# EAGLE design SD (EAGLE 7.2.0)
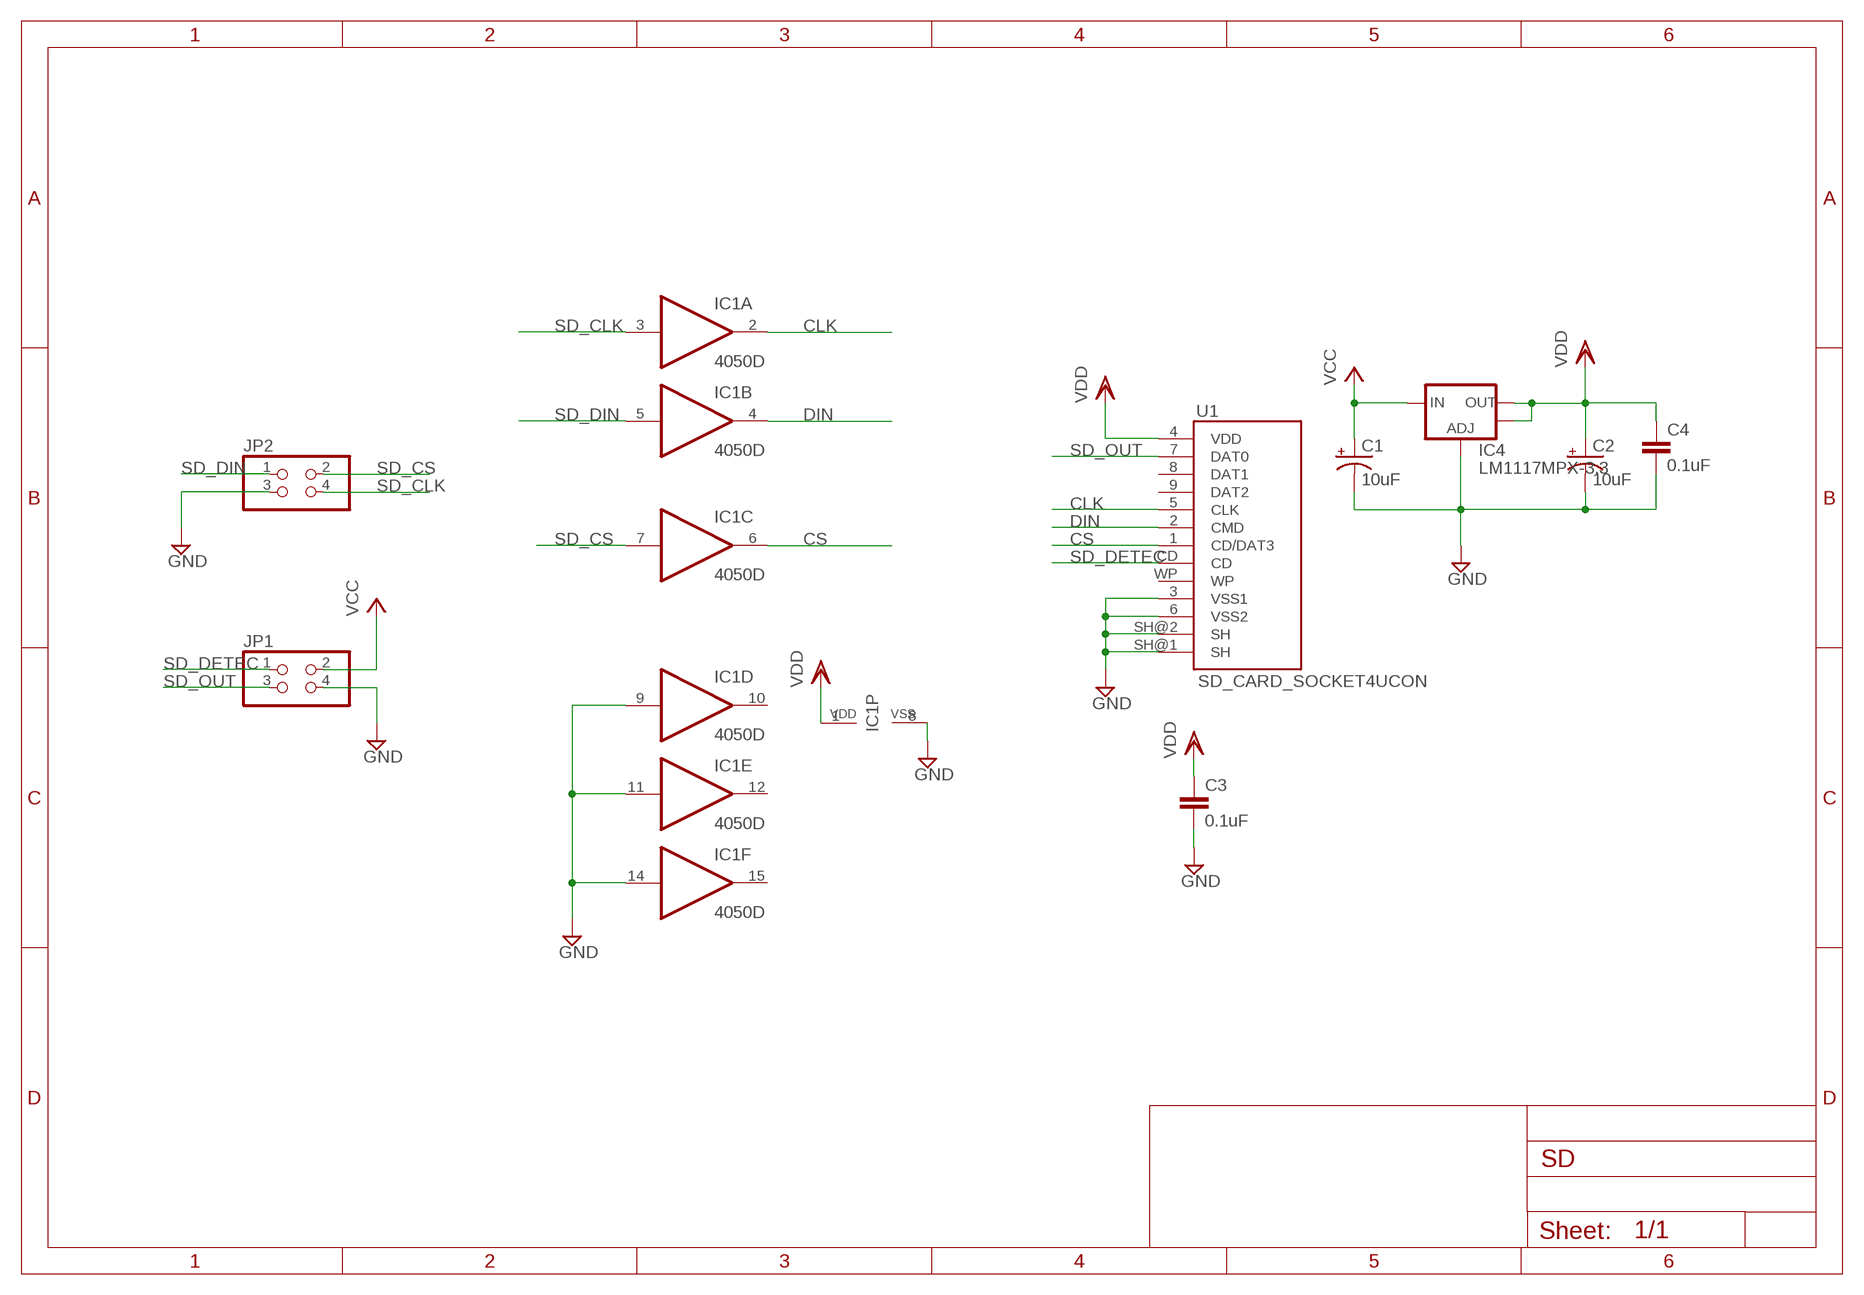
[diagram p0: schematic, sheet 1]

## Parts
C1  10uF  CPOL-USCT3216  [CT3216]
C2  10uF  CPOL-USCT3216  [CT3216]
C3  0.1uF  C-EUC0805  [C0805]
C4  0.1uF  C-EUC0805  [C0805]
IC1  4050D  [SO16]
IC4  LM1117MPX-3.3  V_REG_LM1117SOT223  [SOT223]
JP1  PINHD-2X2  [2X02]
JP2  PINHD-2X2  [2X02]
U1  SD_CARD_SOCKET4UCON  [SDCARD_4UCONN]

## Nets
CLK: IC1.2(A:O) U1.5(CLK)
CS: IC1.6(C:O) U1.1(CD/DAT3)
DIN: IC1.4(B:O) U1.2(CMD)
GND: C1.- C2.- C3.2 C4.2 IC1.8(P:VSS) IC1.9(D:I) IC1.11(E:I) IC1.14(F:I) IC4.1(ADJ) JP1.4 JP2.3 U1.3(VSS1) U1.6(VSS2) U1.SH@1(SH) U1.SH@2(SH)
SD_CLK: IC1.3(A:I) JP2.4
SD_CS: IC1.7(C:I) JP2.2
SD_DETEC: JP1.1 U1.CD
SD_DIN: IC1.5(B:I) JP2.1
SD_OUT: JP1.3 U1.7(DAT0)
VCC: C1.+ IC4.3(IN) JP1.2
VDD: C2.+ C3.1 C4.1 IC1.1(P:VDD) IC4.2(OUT) IC4.4(OUT) U1.4(VDD)
Unconnected: IC1.10(D:O) IC1.12(E:O) IC1.15(F:O) U1.8(DAT1) U1.9(DAT2) U1.WP

## Library data of the parts
C1 C2 = resistor:CPOL-US: POLARIZED CAPACITOR, American symbol
C3 C4 = resistor:C-EU: CAPACITOR, European symbol
IC1 = 40xx:4050: Hex non-inverting BUFFER
IC4 = SparkFun:V_REG_LM1117: Voltage Regulator LM1117 Standard adjustable voltage regulator but in SMD form. Spark Fun Electronics SKU : COM-00595
JP1 JP2 = pinhead:PINHD-2X2: PIN HEADER
U1 = SparkFun-Connectors:SD_CARD_SOCKET: SD Memory Card Connector, push-push normal type, CD enable, WP enable

## Board
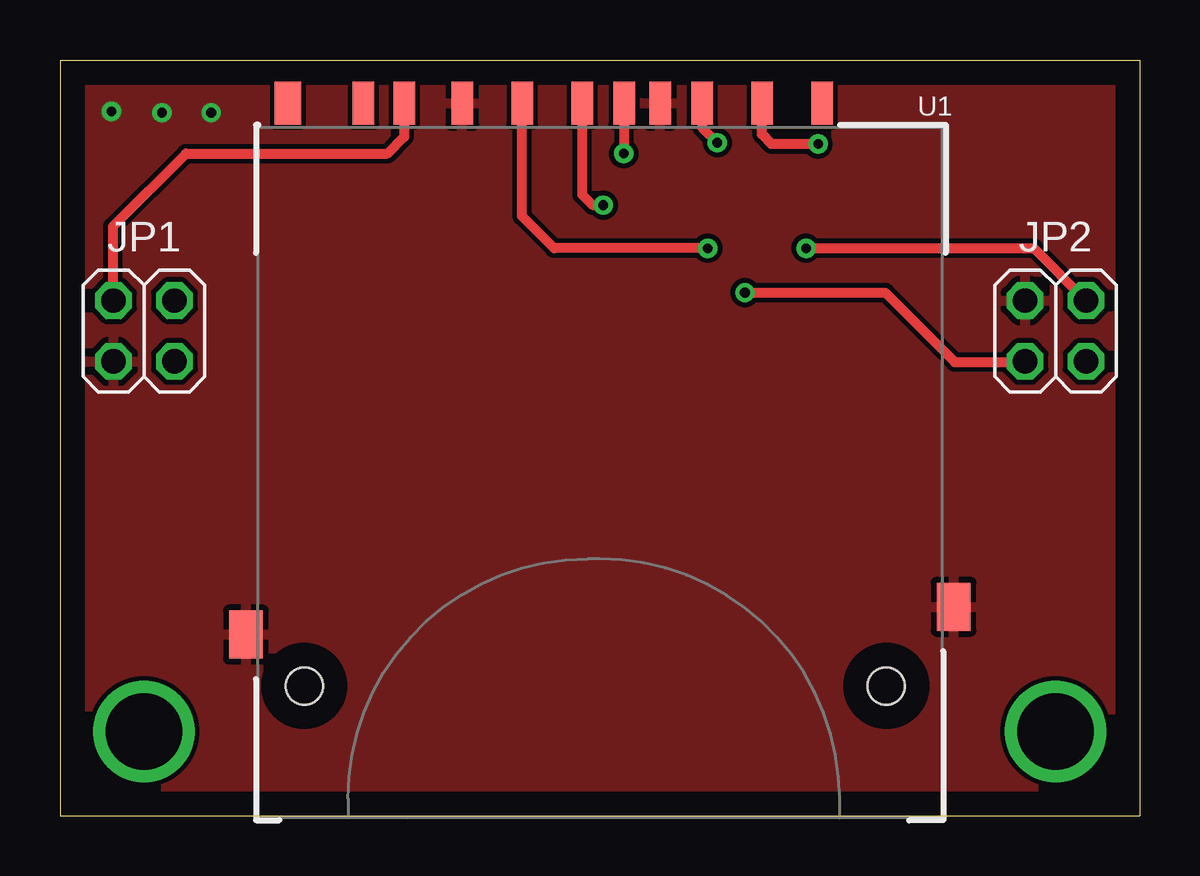
[diagram p1: board, top side]
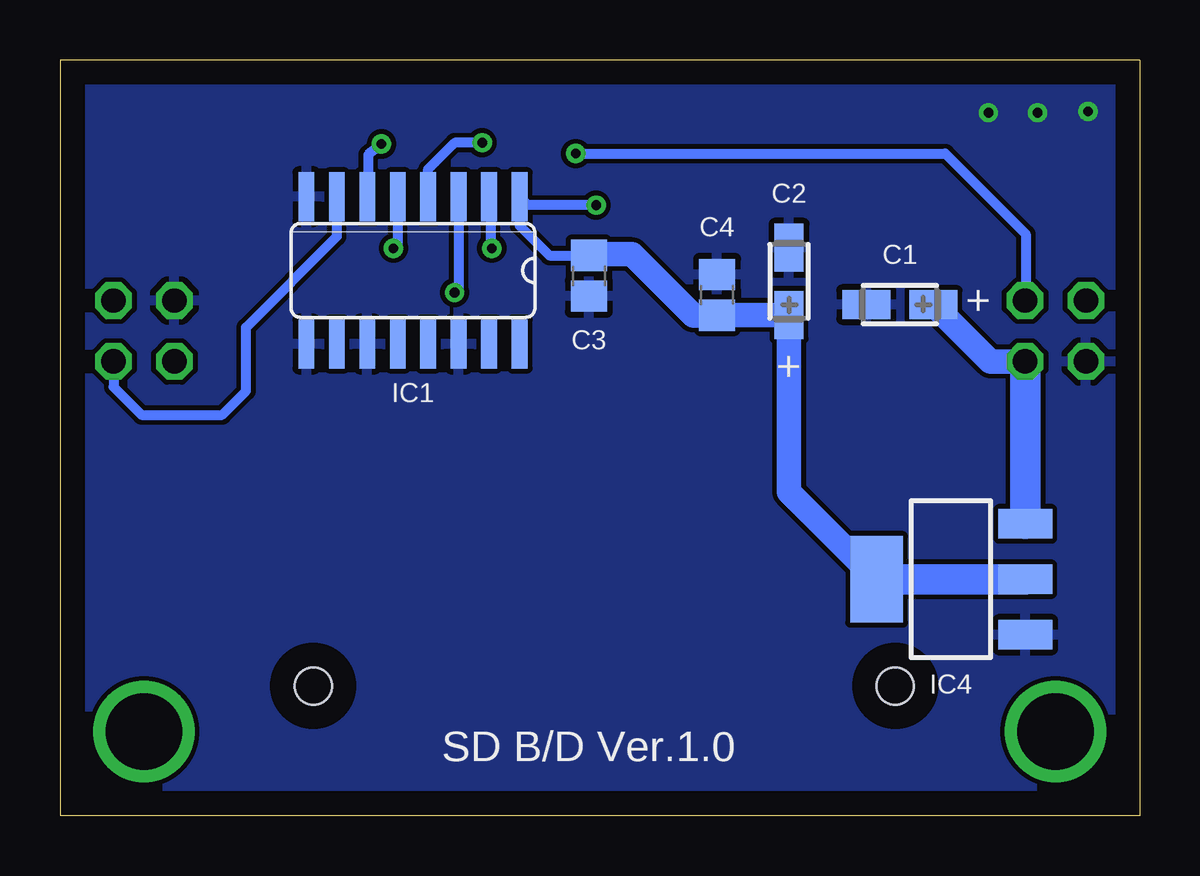
[diagram p2: board, bottom side, seen from below]

Size 45 x 31.5 mm. Coordinates in mm from the lower left corner, seen from the top.
Outline: 45,31.5 45,0 0,0 0,31.5 45,31.5
Copper layers (1*16): Top 0.035mm / dielectric 1.5mm / Bottom 0.035mm
Design rules "default": minimum track width 10mil, minimum drill 24mil, track to track 8mil, track to pad 8mil, pad to pad 8mil, via to via 8mil, smd to smd 8mil, copper to edge 40mil, drill to drill 8mil, minimum pad ring 10mil, minimum via ring 8mil, stop-mask expansion 4mil, vias tented up to drill 0mil, thermal gap 10mil

### Footprints (pad centres in the part's own frame; a part is rotated, then mirrored left to right if it is on the bottom)
CT3216 = smd 2 x 1.2: + 1.4,0; - -1.4,0
C0805 = smd 1.3 x 1.5: 1 -0.85,0; 2 0.85,0
SO16 = smd 0.66 x 2.032: 1 -4.445,-3.073; 2 -3.175,-3.073; 3 -1.905,-3.073; 4 -0.635,-3.073; 5 0.635,-3.073; 6 1.905,-3.073; 7 3.175,-3.073; 8 4.445,-3.073; 9 4.445,3.073; 10 3.175,3.073; 11 1.905,3.073; 12 0.635,3.073; 13 -0.635,3.073; 14 -1.905,3.073; 15 -3.175,3.073; 16 -4.445,3.073
SOT223 = smd 1.219 x 2.235: 1 -2.311,-3.099; 2 0,-3.099; 3 2.311,-3.099 | smd 3.6 x 2.2: 4 0,3.099
2X02 = drill 1.016 octagon: 1 -1.27,-1.27; 2 -1.27,1.27; 3 1.27,-1.27; 4 1.27,1.27
SDCARD_4UCONN = smd 1.8 x 0.9: 1 -1,6.77; 2 -1,4.27; 3 -1,2.52; 4 -1,-0.73; 5 -1,-3.23; 6 -1,-5.73; 7 -1,-8.15; 8 -1,-9.85; 9 -1,9.27; CD -1,1.02 | smd 2 x 1.4: SH@1 20,14.75; SH@2 21.15,-14.75 | smd 1.8 x 1.1: WP -1,-13 | hole 1.55: 23.3,11.94; 23.3,-12.32

### Placement (x,y rotation side)
C1  9.99,21.3 0 bottom
C2  14.61,22.27 270 bottom
C3  22.95,22.5 270 bottom
C4  17.61,21.7 90 bottom
IC1  30.28,22.73 180 bottom
IC4  7.86,9.85 90 bottom
JP1  3.5,20.2 180 top
JP2  41.5,20.2 180 top
U1  22.5,28.7 270 top

### Tracks (layer width: path | path; a pad name or v marks a point on that pad's centre or on a via)
CLK  (via drill 0.4)
  Top 0.406: v27,23.65 20.6,23.65 19.25,25 19.25,29.68 U1.5
  Bottom 0.406: IC1.2 27.05,25.8 | 27.05,25.8 | 27.05,25.8 27.05,23.7 v27,23.65
CS  (via drill 0.4)
  Top 0.406: v31.6,28 29.65,28 29.25,28.4 29.25,29.68 U1.1
  Bottom 0.406: v31.6,28 32.15,27.55 32.15,25.84 IC1.6
DIN  (via drill 0.4)
  Top 0.406: U1.2 26.77,28.68 v27.4,28.05
  Bottom 0.406: v27.4,28.05 28.55,28.05 29.65,26.95 IC1.4
GND  (via drill 0.4)
  other vias: 2.15,29.35 4.25,29.3 6.3,29.3
  pour Bottom: 0.15,31.55 0.1,31.55 0.1,-0.6 45.4,-0.6 45.4,31.85 0.15,31.85
  pour Top: -0.1,31.5 -0.15,31.5 -0.15,-0.65 45.4,-0.65 45.4,31.8 -0.15,31.8 -0.15,31.55
N$2  (via drill 3.2)
  other vias: 3.5,3.5
N$3  (via drill 3.2)
  other vias: 41.5,3.5
SD_CLK  (via drill 0.4)
  Top 0.406: v28.55,21.8 34.4,21.8 37.3,18.9 40.2,18.9 JP2.4
  Bottom 0.406: IC1.3 28.38,21.97 v28.55,21.8
SD_CS
  Bottom 0.406: IC1.7 33.46,24.14 37.25,20.35 37.25,17.7 38.25,16.7 41.6,16.7 42.77,17.87 JP2.2
SD_DETEC  (via drill 0.4)
  Top 0.406: U1.CD 23.52,27.62 v23.5,27.6
  Bottom 0.406: JP1.1 4.75,21.49 4.75,24.25 8.1,27.6 v23.5,27.6
SD_DIN  (via drill 0.4)
  Top 0.406: v31.1,23.65 40.59,23.65 JP2.1
  Bottom 0.406: IC1.5 30.92,23.83 v31.1,23.65
SD_OUT
  Top 0.406: U1.7 14.35,28.3 13.65,27.6 5.25,27.6 2.2,24.55 2.2,21.5
  Top 0.61: 2.2,21.5 JP1.3
VCC
  Bottom 1.016: JP1.2 6.22,18.93 C1.+
  Bottom 1.27: JP1.2 IC4.3
VDD  (via drill 0.4)
  Top 0.406: U1.4 21.77,25.88 22.2,25.45 v22.65,25.45
  Bottom 0.406: C3.1 24.6,23.35 25.84,24.59 IC1.1 25.49,25.45 v22.65,25.45
  Bottom 1.016: IC4.4 14.61,13.5 C2.+ 17.6,20.87 C4.1 18.6,20.85 21.15,23.4 22.9,23.4 C3.1
  Bottom 1.27: IC4.2 IC4.4

### Text on the board
bNames: + | + | SD B/D Ver.1.0